# Altium schematic sheet G11_PowerSelfLock.SCHDOC
size A3; SheetNumber: 0; SheetTotal: 0
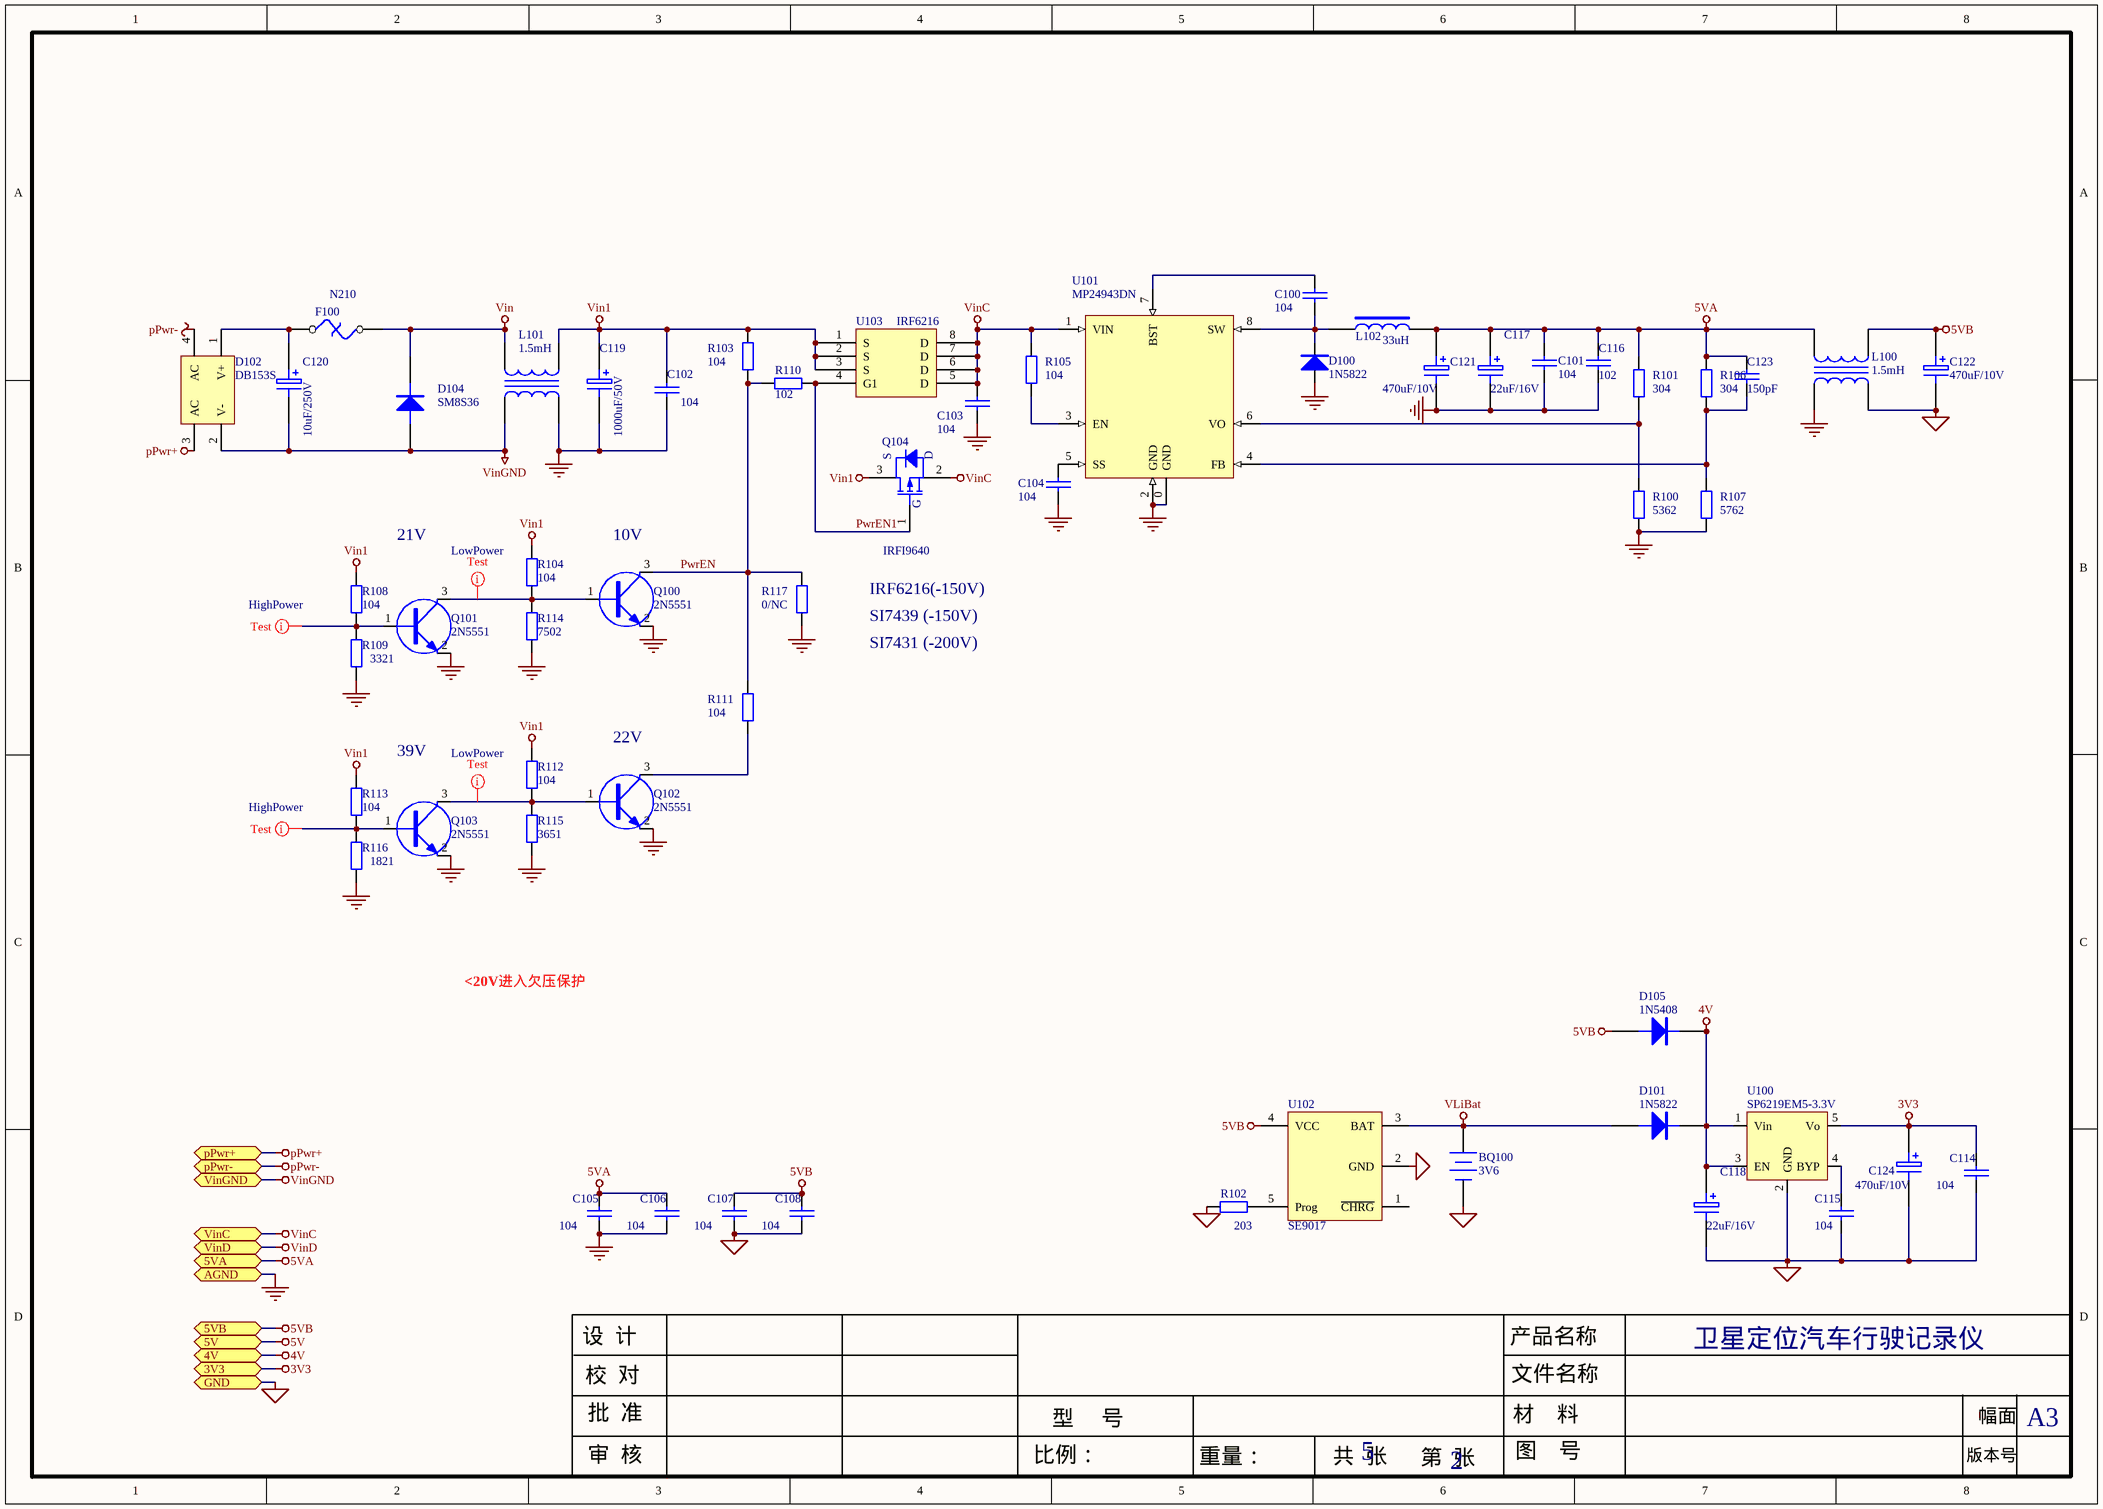
[diagram p0: G11_PowerSelfLock.SCHDOC]

## Parts
BQ100  3V6  [BT-2.0]
C100  104  [C0603]
C101  104  [C0603]
C102  104  [C0603]
C103  104  [C0603]
C104  104  [C0603]
C105  104  [C0603]
C106  104  [C0603]
C107  104  [C0603]
C108  104  [C0603]
C114  104  [C0603]
C115  104  [C0603]
C116  102  [C0603]
C117  22uF/16V  [A(3216)]
C118  22uF/16V  [RB-3.5mm]
C119  1000uF/50V  [RB.2/.4]
C120  10uF/250V  [RB-3.5mm]
C121  470uF/10V  [RB-3.5mm]
C122  470uF/10V  [RB-3.5mm]
C123  150pF  [C0603]
C124  470uF/10V  [RB-3.5mm]
D100  1N5822  [D2010]
D101  1N5822  [D2010]
D102  DB153S  [DB156S]
D104  SM8S36  [DO-218]
D105  1N5408  [D-214]
F100  N210  [RAD0.2]
L100  1.5mH  [CMH-5p]
L101  1.5mH  [CMH-5p]
L102  33uH  [L10uH_H]
Q100  2N5551  [SOT-233]
Q101  2N5551  [SOT-233]
Q102  2N5551  [SOT-233]
Q103  2N5551  [SOT-233]
Q104  IRFI9640  [TO-220-3]
R100  5362  [R0603]
R101  304  [R0603]
R102  203  [R0603]
R103  104  [R0603]
R104  104  [R0603]
R105  104  [R0603]
R106  304  [R0603]
R107  5762  [R0603]
R108  104  [R0603]
R109  3321  [R0603]
R110  102  [R0603]
R111  104  [R0603]
R112  104  [R0603]
R113  104  [R0603]
R114  7502  [R0603]
R115  3651  [R0603]
R116  1821  [R0603]
R117  0/NC  [R0603]
U100  SP6219EM5-3.3V  [SOT-235]
U101  MP24943DN  [SOP8-Hot]
U102  SE9017  [SOT-235]
U103  IRF6216  [SOP8-Power]

## Ports
3V3 (bidir), 4V (bidir), 5V (bidir), 5VA (bidir), 5VB (bidir), AGND (bidir), GND (bidir), pPwr+ (bidir), pPwr- (bidir), VinC (bidir), VinD (bidir), VinGND (bidir)

## Nets
3V3: C114.1 C124.1 U100.5(Vo) ; port 3V3
4V: C118.1 D101.2 D105.2 U100.1(Vin) U100.3(EN) ; port 4V
5V: port 5V
5VA: C101.2 C105.1 C106.1 C116.2 C117.1 C121.1 C123.2 L100.1 L102.2 R101.2 R106.2 ; port 5VA
5VB: C107.1 C108.1 C122.1 D105.1 L100.3 U102.4(VCC) ; port 5VB
AGND: C101.1 C102.2 C103.2 C104.2 C105.2 C106.2 C116.1 C117.2 C119.2 C121.2 D100.1 L100.2 L101.2 Q100.2(E) Q101.2(E) Q102.2(E) Q103.2(E) R100.1 R107.1 R109.1 R114.1 R115.1 R116.1 R117.1 U101.0(GND) U101.2(GND) ; port AGND
GND: BQ100.2(-) C107.2 C108.2 C114.2 C115.1 C118.2 C122.2 C124.2 L100.4 R102.2 U100.2(GND) U102.2(GND) ; port GND
pPwr+: D102.3(AC) ; port pPwr+
pPwr-: D102.4(AC) ; port pPwr-
Vin: D104.2 F100.2 L101.3
Vin1: C102.1 C119.1 L101.1 Q104.3(S) R103.2 R104.2 R108.2 R112.2 R113.2 U103.1(S) U103.2(S) U103.3(S)
VinC: C103.1 Q104.2(D) R105.2 U101.1(VIN) U103.5(D) U103.6(D) U103.7(D) U103.8(D) ; port VinC
VinD: port VinD
VinGND: C120.2 D102.2(V-) D104.1 L101.4 ; port VinGND
VLiBat: BQ100.1(+) D101.1 U102.3(BAT)
PwrEN: Q100.3(C) R103.1 R110.2 R111.2 R117.2
PwrEN1: Q104.1(G) R110.1 U103.4(G1)
NetC100_1: C100.1 U101.7(BST)
NetC100_2: C100.2 D100.2 L102.1 U101.8(SW)
NetC104_1: C104.1 U101.5(SS)
NetC115_2: C115.2 U100.4(BYP)
NetC120_1: C120.1 D102.1(V+) F100.1
NetC123_1: C123.1 R106.1 R107.2 U101.4(FB)
NetQ100_1: Q100.1(B) Q101.3(C) R104.1 R114.2
NetQ101_1: Q101.1(B) R108.1 R109.2
NetQ102_1: Q102.1(B) Q103.3(C) R112.1 R115.2
NetQ102_3: Q102.3(C) R111.1
NetQ103_1: Q103.1(B) R113.1 R116.2
NetR100_2: R100.2 R101.1 U101.6(VO)
NetR102_1: R102.1 U102.5(Prog)
NetR105_1: R105.1 U101.3(EN)

Not connected (* = marked no-connect by the designer): U102 1(~{CHRG})

## Layout directives
: LowPower: NetQ100_1, NetQ102_1
: HighPower: NetQ101_1, NetQ103_1

## Notes on the sheet
- 21V
- (near Q100) 10V
- SI7431 (-200V)
- SI7439 (-150V)
- IRF6216(-150V)
- 39V
- (near Q102) 22V
- <20V进入欠压保护
- 设  计
- 校  对
- 产品名称
- 文件名称
- 卫星定位汽车行驶记录仪
- 审  核
- 批  准
- 比例：
- 型     号
- 5
- 材    料
- 图    号
- 版本号
- 幅面
- A3
- 重量：
- 共  张
- 第  张
- 2

## Library data of the parts
BQ100 = Battery: 2.54锂电池插座; Manufacturer: Generic Components; Published: 1999
C100-C108 C114-C116 C123 = CAP: 贴片电容
  C100 C101 C103 C104 C116 C123: Cap: 贴片电容
  C102 C115: Cap: Cap
C117 C118 = ELECTRO1: 贴片钽电容; C: Cap
C119 C120 = ELECTRO1: 直插电解; C: Cap
C121 C122 C124 = ELECTRO1: 直插电解; C: 电解电容
D100 D101 D105 = DIODE: 贴片二极管; D: Didoe
D102 = Bridge2: 整流桥; Published: 24-Mar-1999; Revision: July-2002: Re-released for DXP Platform.; Publisher: Altium Limited
D104 = DIODE: 贴片瞬态抑制二极管; D: Didoe
F100 = THERMAL FUSE: 直插自恢保险丝; F: F
L100 L101 = Trans Adj: 贴片共模电感; Published: 24-Mar-1999; Revision: July-2002: Re-released for DXP Platform.; Publisher: Altium Limited
L102 = INDUCTOR2: 贴片工字电感; L: L
Q100-Q103 = 9013: 贴片三极管
Q104 = MOSFET-P_1: 贴片P沟MOS管
R100-R117 = Res2: 贴片电阻; Manufacturer: Generic Components; Class: Passive; SubClass: Resistor; Value: 15K; Published: 08/06/2000; Publisher: Altium Hobart Technology Centre
U100 = SPX5205: 贴片电源IC
U101 = MP24943DN: IC 同步降压IC
U102 = SE9016: 贴片充电IC
U103 = IRF7853: 贴片PMOS管